# EAGLE schematic ir_rx_test (EAGLE 9.0.1)
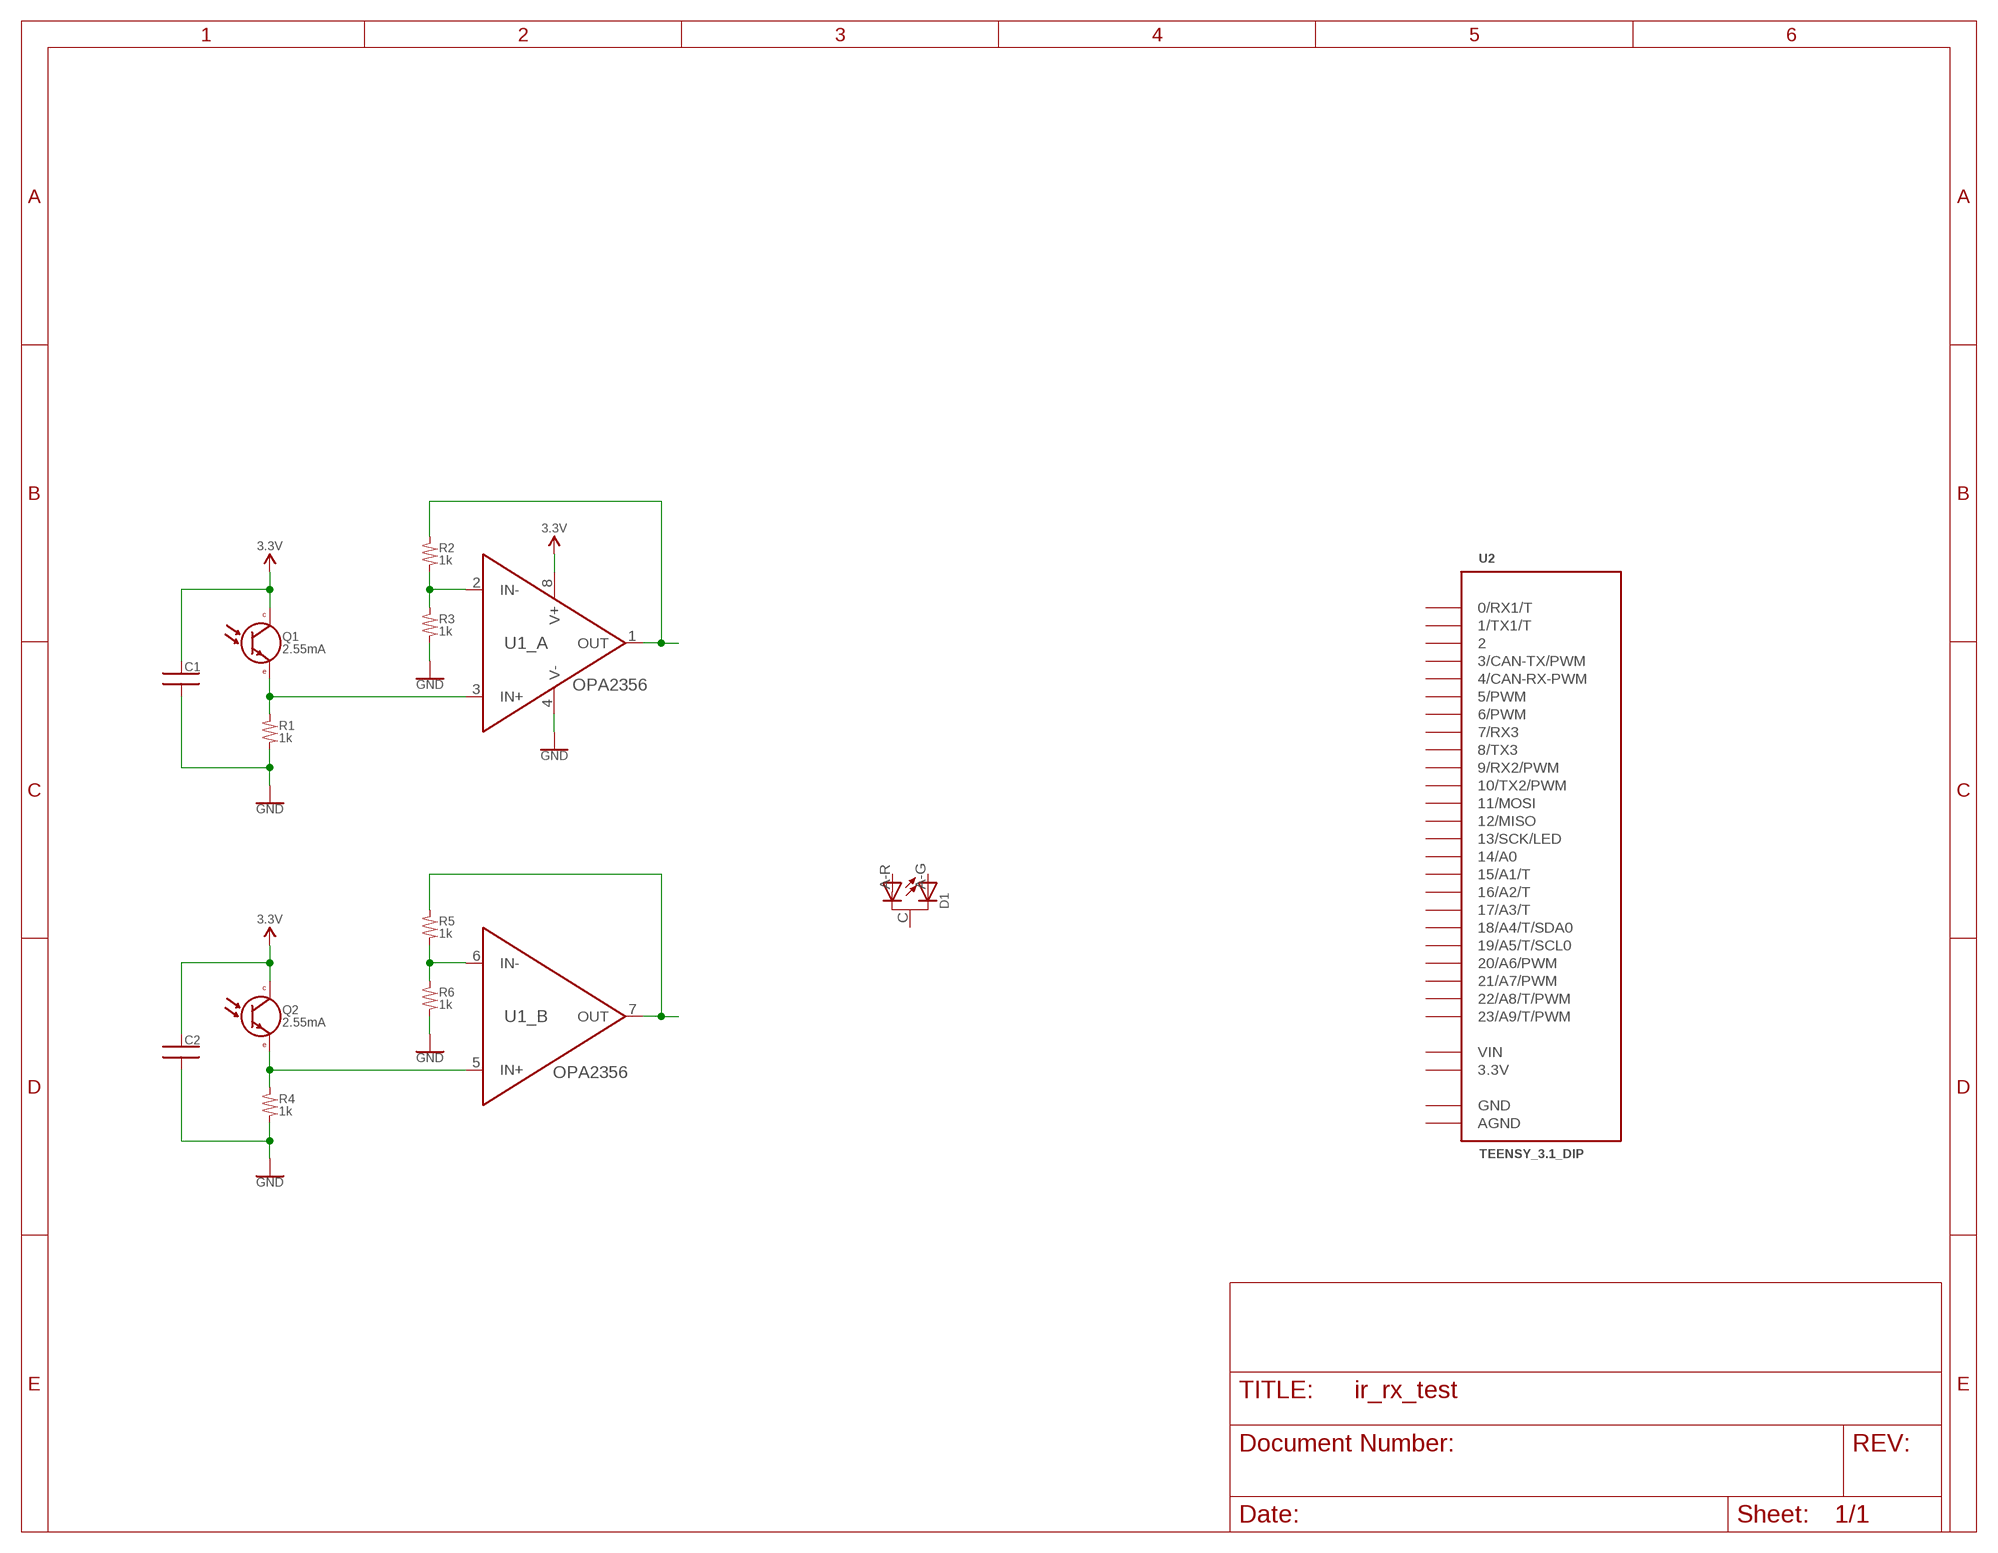
[diagram p0: schematic, sheet 1]

## Parts
C1  CAP_SMD_0603  [0603]
C2  CAP_SMD_0603  [0603]
D1  TLVS5100  [TLSV5100]
Q1  2.55mA  PHOTOTRANSISTOR_OPXXX  [OP550+]
Q2  2.55mA  PHOTOTRANSISTOR_OPXXX  [OP550+]
R1  1k  RES_SMD0805  [0805]
R2  1k  RES_SMD0805  [0805]
R3  1k  RES_SMD0805  [0805]
R4  1k  RES_SMD0805  [0805]
R5  1k  RES_SMD0805  [0805]
R6  1k  RES_SMD0805  [0805]
U1  OPA2356  [SOIC_8]
U2  TEENSY_3.1_DIP  [TEENSY_3.1_DIP]

## Nets
3.3V: C1.1 C2.1 Q1.C Q2.C U1.8(_A:V+)
GND: C1.2 C2.2 R1.2 R3.2 R4.2 R6.2 U1.4(_A:V-)
N$1: Q1.E R1.1 U1.3(_A:IN+)
N$2: R2.2 R3.1 U1.2(_A:IN-)
N$3: R2.1 U1.1(_A:OUT)
N$4: Q2.E R4.1
N$5: R5.2 R6.1
N$6: R5.1 U1.7(_B:OUT)
Unconnected: D1.A-G(A2) D1.A-R(A1) D1.C U1.5(_B:IN+) U1.6(_B:IN-) U2.0(0/RX1/T) U2.1(1/TX1/T) U2.2 U2.3(3/CAN-TX/PWM) U2.4(4/CAN-RX-PWM) U2.5(5/PWM) U2.6(6/PWM) U2.7(7/RX3) U2.8(8/TX3) U2.9(9/RX2/PWM) U2.10(10/TX2/PWM) U2.11(11/MOSI) U2.12(12/MISO) U2.13(13/SCK/LED) U2.14/A0 U2.15/A1(15/A1/T) U2.16/A2(16/A2/T) U2.17/A3(17/A3/T) U2.18/A4(18/A4/T/SDA0) U2.19/A5(19/A5/T/SCL0) U2.20/A6(20/A6/PWM) U2.21/A7(21/A7/PWM) U2.22/A8(22/A8/T/PWM) U2.23/A9(23/A9/T/PWM)

## Power pins joined to a net without a drawn wire
3.3V: U2.3.3V
AGND: U2.AGND
GND: U2.GND
VIN: U2.VIN

## Library data of the parts
C1 C2 = meltylib:CAP_SMD
D1 = meltylib:TLVS5100
Q1 Q2 = meltylib:PHOTOTRANSISTOR
R1-R6 = meltylib:RES_SMD
U1 = meltylib:OPA2356: TI Dual 200Mhz Opamp http://www.ti.com/lit/ds/symlink/opa2356.pdf
U2 = meltylib:TEENSY_3.1_DIP